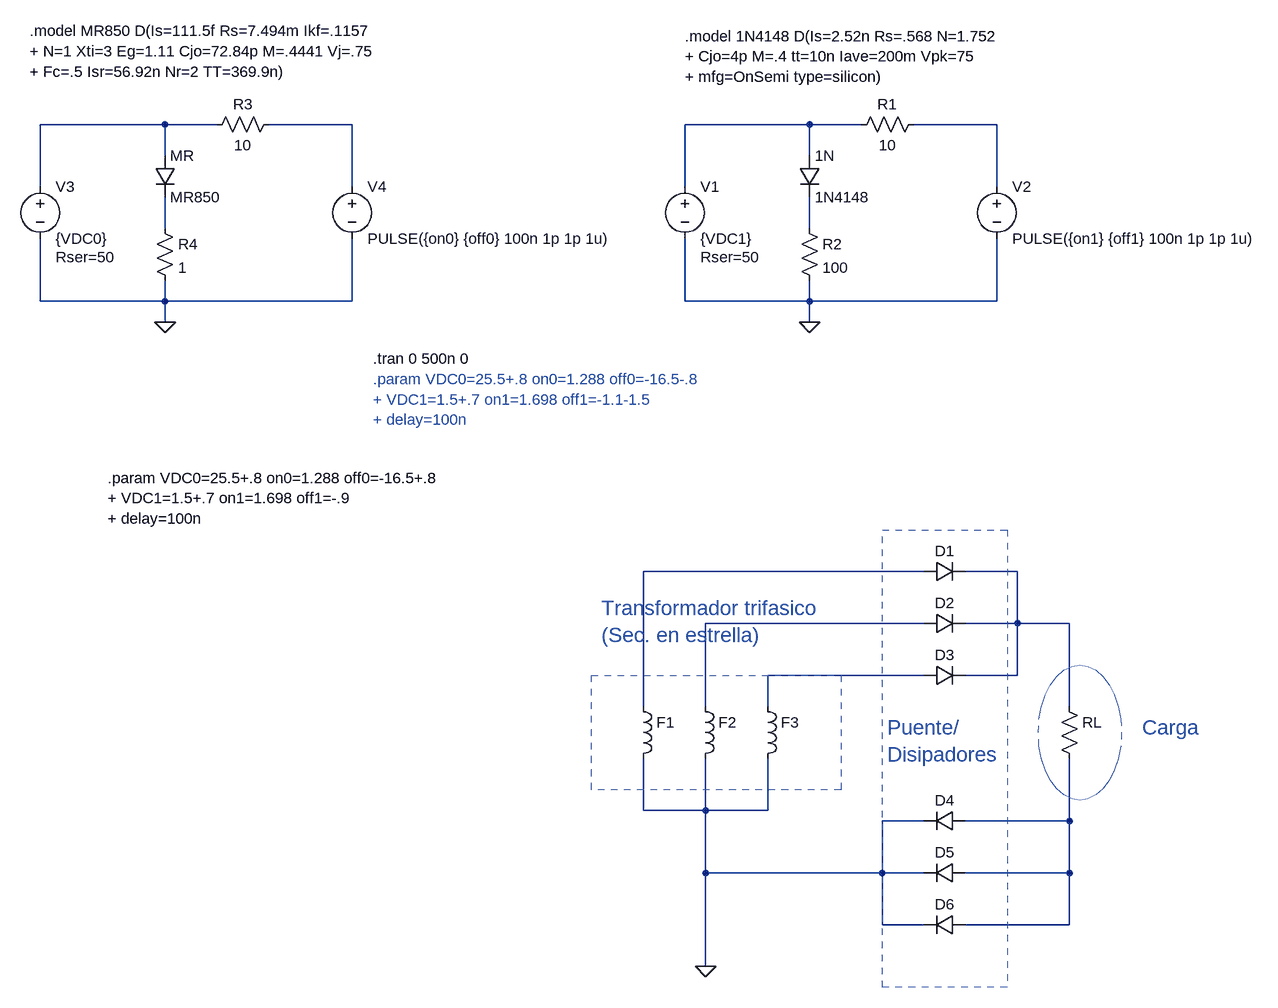
[diagram p0: schematic compDiodos.asc]
compDiodos.asc, the LTspice schematic file:
Version 4
SHEET 1 1716 984
WIRE -16 -464 -208 -464
WIRE 64 -464 -16 -464
WIRE 272 -464 144 -464
WIRE 976 -464 784 -464
WIRE 1056 -464 976 -464
WIRE 1264 -464 1136 -464
WIRE -16 -416 -16 -464
WIRE 976 -416 976 -464
WIRE -208 -368 -208 -464
WIRE 272 -368 272 -464
WIRE 784 -368 784 -464
WIRE 1264 -368 1264 -464
WIRE -16 -304 -16 -352
WIRE 976 -304 976 -352
WIRE -208 -192 -208 -288
WIRE -16 -192 -16 -224
WIRE -16 -192 -208 -192
WIRE 272 -192 272 -288
WIRE 272 -192 -16 -192
WIRE 784 -192 784 -288
WIRE 976 -192 976 -224
WIRE 976 -192 784 -192
WIRE 1264 -192 1264 -288
WIRE 1264 -192 976 -192
WIRE -16 -160 -16 -192
WIRE 976 -160 976 -192
WIRE 1152 224 720 224
WIRE 1296 224 1216 224
WIRE 1152 304 816 304
WIRE 1296 304 1296 224
WIRE 1296 304 1216 304
WIRE 1376 304 1296 304
WIRE 1152 384 912 384
WIRE 1296 384 1296 304
WIRE 1296 384 1216 384
WIRE 720 432 720 224
WIRE 816 432 816 304
WIRE 912 432 912 384
WIRE 1376 432 1376 304
WIRE 720 592 720 512
WIRE 816 592 816 512
WIRE 816 592 720 592
WIRE 912 592 912 512
WIRE 912 592 816 592
WIRE 1152 608 1088 608
WIRE 1376 608 1376 512
WIRE 1376 608 1216 608
WIRE 816 688 816 592
WIRE 1088 688 1088 608
WIRE 1088 688 816 688
WIRE 1152 688 1088 688
WIRE 1376 688 1376 608
WIRE 1376 688 1216 688
WIRE 1088 768 1088 688
WIRE 1152 768 1088 768
WIRE 1376 768 1376 688
WIRE 1376 768 1216 768
WIRE 816 832 816 688
FLAG 976 -160 0
FLAG -16 -160 0
FLAG 816 832 0
SYMBOL diode -32 -416 R0
SYMATTR InstName MR
SYMATTR Value MR850
SYMBOL voltage 784 -384 R0
WINDOW 123 0 0 Left 0
WINDOW 39 24 124 Left 2
SYMATTR SpiceLine Rser=50
SYMATTR InstName V1
SYMATTR Value {VDC1}
SYMBOL res 1152 -480 R90
WINDOW 0 0 56 VBottom 2
WINDOW 3 32 56 VTop 2
SYMATTR InstName R1
SYMATTR Value 10
SYMBOL res 960 -320 R0
SYMATTR InstName R2
SYMATTR Value 100
SYMBOL voltage 1264 -384 R0
WINDOW 123 0 0 Left 0
WINDOW 39 0 0 Left 0
SYMATTR InstName V2
SYMATTR Value PULSE({on1} {off1} 100n 1p 1p 1u)
SYMBOL diode 960 -416 R0
SYMATTR InstName 1N
SYMATTR Value 1N4148
SYMBOL voltage -208 -384 R0
WINDOW 123 0 0 Left 0
WINDOW 39 24 124 Left 2
SYMATTR SpiceLine Rser=50
SYMATTR InstName V3
SYMATTR Value {VDC0}
SYMBOL res 160 -480 R90
WINDOW 0 0 56 VBottom 2
WINDOW 3 32 56 VTop 2
SYMATTR InstName R3
SYMATTR Value 10
SYMBOL res -32 -320 R0
SYMATTR InstName R4
SYMATTR Value 1
SYMBOL voltage 272 -384 R0
WINDOW 123 0 0 Left 0
WINDOW 39 0 0 Left 0
SYMATTR InstName V4
SYMATTR Value PULSE({on0} {off0} 100n 1p 1p 1u)
SYMBOL ind 704 416 R0
WINDOW 3 36 80 Invisible 2
SYMATTR InstName F1
SYMATTR Value 1
SYMBOL ind 800 416 R0
WINDOW 3 36 80 Invisible 2
SYMATTR InstName F2
SYMATTR Value 1
SYMBOL ind 896 416 R0
WINDOW 3 36 80 Invisible 2
SYMATTR InstName F3
SYMATTR Value 1
SYMBOL res 1360 416 R0
WINDOW 3 36 76 Invisible 2
SYMATTR InstName RL
SYMATTR Value 1
SYMBOL diode 1152 240 R270
WINDOW 0 32 32 VTop 2
WINDOW 3 0 32 Invisible 2
SYMATTR InstName D1
SYMBOL diode 1216 592 R90
WINDOW 0 0 32 VBottom 2
WINDOW 3 32 32 Invisible 2
SYMATTR InstName D4
SYMBOL diode 1152 320 R270
WINDOW 0 32 32 VTop 2
WINDOW 3 0 32 Invisible 2
SYMATTR InstName D2
SYMBOL diode 1152 400 R270
WINDOW 0 32 32 VTop 2
WINDOW 3 0 32 Invisible 2
SYMATTR InstName D3
SYMBOL diode 1216 672 R90
WINDOW 0 0 32 VBottom 2
WINDOW 3 32 32 Invisible 2
SYMATTR InstName D5
SYMBOL diode 1216 752 R90
WINDOW 0 0 32 VBottom 2
WINDOW 3 32 32 Invisible 2
SYMATTR InstName D6
TEXT -224 -608 Left 2 !.model MR850 D(Is=111.5f Rs=7.494m Ikf=.1157\n+ N=1 Xti=3 Eg=1.11 Cjo=72.84p M=.4441 Vj=.75 \n+ Fc=.5 Isr=56.92n Nr=2 TT=369.9n)
TEXT 304 -104 Left 2 !.tran 0 500n 0
TEXT 304 -72 Left 2 ;.param VDC0=25.5+.8 on0=1.288 off0=-16.5-.8 \n+ VDC1=1.5+.7 on1=1.698 off1=-1.1-1.5\n+ delay=100n
TEXT 784 -600 Left 2 !.model 1N4148 D(Is=2.52n Rs=.568 N=1.752 \n+ Cjo=4p M=.4 tt=10n Iave=200m Vpk=75 \n+ mfg=OnSemi type=silicon)
TEXT -104 80 Left 2 !.param VDC0=25.5+.8 on0=1.288 off0=-16.5+.8 \n+ VDC1=1.5+.7 on1=1.698 off1=-.9 \n+ delay=100n
TEXT 656 280 Left 3 ;Transformador trifasico\n(Sec. en estrella)
TEXT 1096 464 Left 3 ;Puente/\nDisipadores
TEXT 1488 464 Left 3 ;Carga
RECTANGLE Normal 1024 560 640 384 1
RECTANGLE Normal 1280 864 1088 160 1
CIRCLE Normal 1456 576 1328 368 1

The netlist it stands for:
* compDiodos.asc
D§MR N001 N005 MR850
V1 N003 0 {VDC1} Rser=50
R1 N004 N003 10
R2 N006 0 100
V2 N004 0 PULSE({on1} {off1} 100n 1p 1p 1u)
D§1N N003 N006 1N4148
V3 N001 0 {VDC0} Rser=50
R3 N002 N001 10
R4 N005 0 1
V4 N002 0 PULSE({on0} {off0} 100n 1p 1p 1u)
L§F1 N007 0 1
L§F2 N009 0 1
L§F3 N010 0 1
RL N008 N011 1
D1 N007 N008 D
D4 N011 0 D
D2 N009 N008 D
D3 N010 N008 D
D5 N011 0 D
D6 N011 0 D
.model D D
.lib standard.dio
.model MR850 D(Is=111.5f Rs=7.494m Ikf=.1157
+ N=1 Xti=3 Eg=1.11 Cjo=72.84p M=.4441 Vj=.75
+ Fc=.5 Isr=56.92n Nr=2 TT=369.9n)
.tran 0 500n 0
* .param VDC0=25.5+.8 on0=1.288 off0=-16.5-.8
* + VDC1=1.5+.7 on1=1.698 off1=-1.1-1.5
* + delay=100n
.model 1N4148 D(Is=2.52n Rs=.568 N=1.752
+ Cjo=4p M=.4 tt=10n Iave=200m Vpk=75
+ mfg=OnSemi type=silicon)
.param VDC0=25.5+.8 on0=1.288 off0=-16.5+.8
+ VDC1=1.5+.7 on1=1.698 off1=-.9
+ delay=100n
* Transformador trifasico
* (Sec. en estrella)
* Puente/
* Disipadores
* Carga
.backanno
.end